# EAGLE design 7segement4digits1badidea-max6958-mk-1.0 (EAGLE 6.5.0)
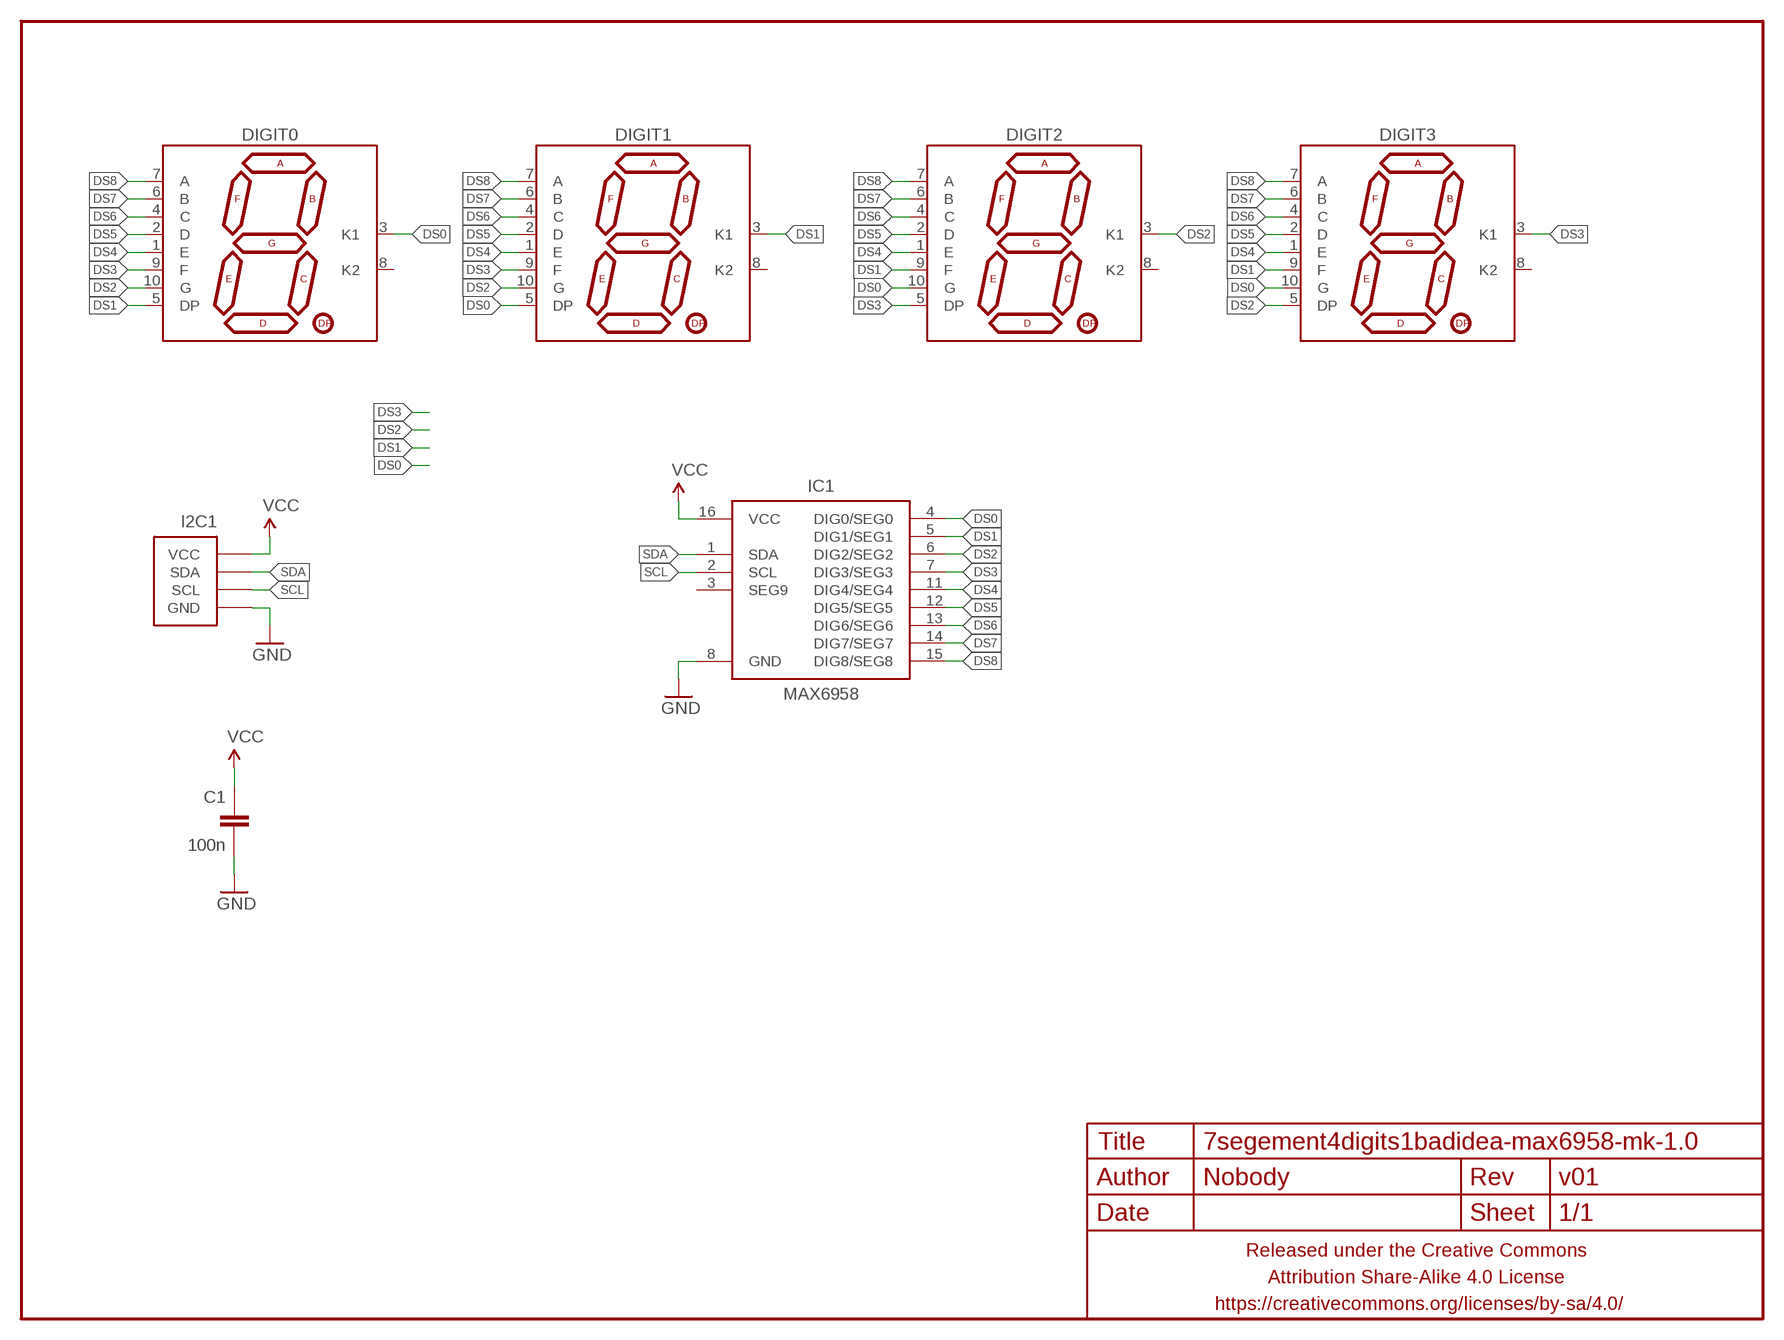
[diagram p0: schematic, sheet 1]

## Parts
C1  100n  CAPACITOR-CERAMIC025-024X044  [C025-024X044]
DIGIT0  7SEG_1DIGPTH-25.4MM  [7SEG_1DIG_25.4MM]
DIGIT1  7SEG_1DIGPTH-25.4MM  [7SEG_1DIG_25.4MM]
DIGIT2  7SEG_1DIGPTH-25.4MM  [7SEG_1DIG_25.4MM]
DIGIT3  7SEG_1DIGPTH-25.4MM  [7SEG_1DIG_25.4MM]
FRAME1  FRAME-LETTERNO_PACKAGE  [DUMMY]
I2C1  M04-I2CPTH-0.1IN-CENTERED  [1X04-PTH-VERT-I2C-CENTERED]
IC1  MAX6958  [DIL16]

## Nets
DS0: DIGIT0.3(K1) DIGIT1.5(DP) DIGIT2.10(G) DIGIT3.10(G) IC1.4(DIG0/SEG0)
DS1: DIGIT0.5(DP) DIGIT1.3(K1) DIGIT2.9(F) DIGIT3.9(F) IC1.5(DIG1/SEG1)
DS2: DIGIT0.10(G) DIGIT1.10(G) DIGIT2.3(K1) DIGIT3.5(DP) IC1.6(DIG2/SEG2)
DS3: DIGIT0.9(F) DIGIT1.9(F) DIGIT2.5(DP) DIGIT3.3(K1) IC1.7(DIG3/SEG3)
DS4: DIGIT0.1(E) DIGIT1.1(E) DIGIT2.1(E) DIGIT3.1(E) IC1.11(DIG4/SEG4)
DS5: DIGIT0.2(D) DIGIT1.2(D) DIGIT2.2(D) DIGIT3.2(D) IC1.12(DIG5/SEG5)
DS6: DIGIT0.4(C) DIGIT1.4(C) DIGIT2.4(C) DIGIT3.4(C) IC1.13(DIG6/SEG6)
DS7: DIGIT0.6(B) DIGIT1.6(B) DIGIT2.6(B) DIGIT3.6(B) IC1.14(DIG7/SEG7)
DS8: DIGIT0.7(A) DIGIT1.7(A) DIGIT2.7(A) DIGIT3.7(A) IC1.15(DIG8/SEG8)
GND: C1.2 I2C1.GND IC1.8(GND)
SCL: I2C1.SCL IC1.2(SCL)
SDA: I2C1.SDA IC1.1(SDA)
VCC: C1.1 I2C1.VCC IC1.16(VCC)
Unconnected: DIGIT0.8(K2) DIGIT1.8(K2) DIGIT2.8(K2) DIGIT3.8(K2) IC1.3(SEG9)

## Library data of the parts
C1 = A_butts:CAPACITOR-CERAMIC: CAPACITOR, European symbol
DIGIT0 DIGIT1-DIGIT3 = A_butts:7SEG_1DIG
FRAME1 = A_butts:FRAME-LETTER: Schematic Frame Standard 8.5x11 US Letter frame; DESIGNER: Nobody; VERSION: v01
I2C1 = A_butts:M04-I2C
IC1 = A_butts:MAX6958

## Board
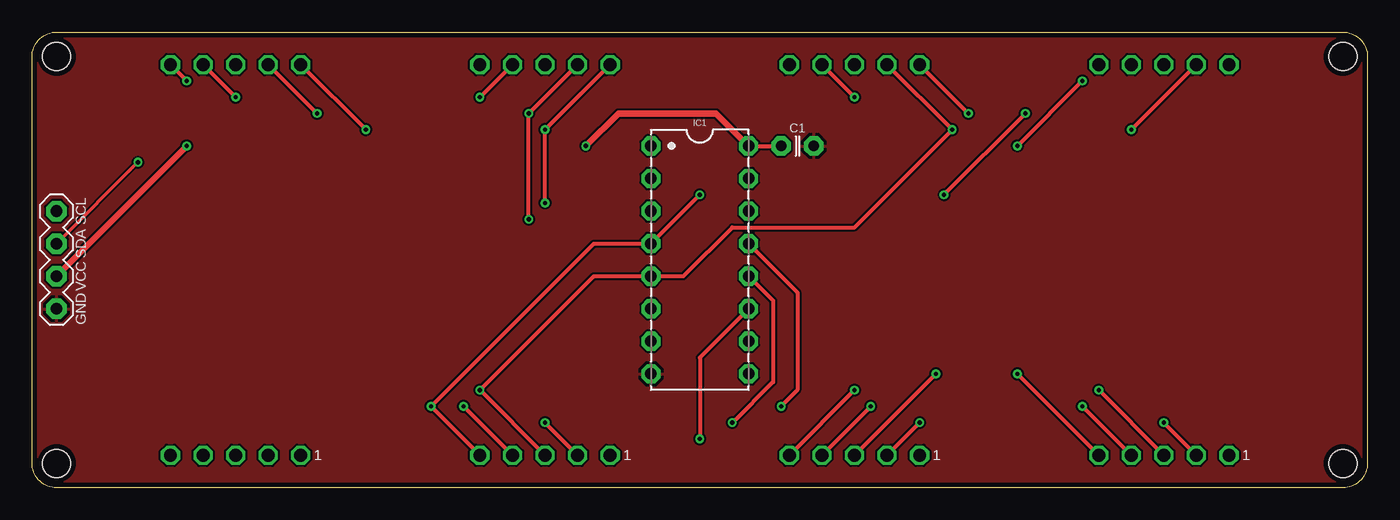
[diagram p1: board, top side]
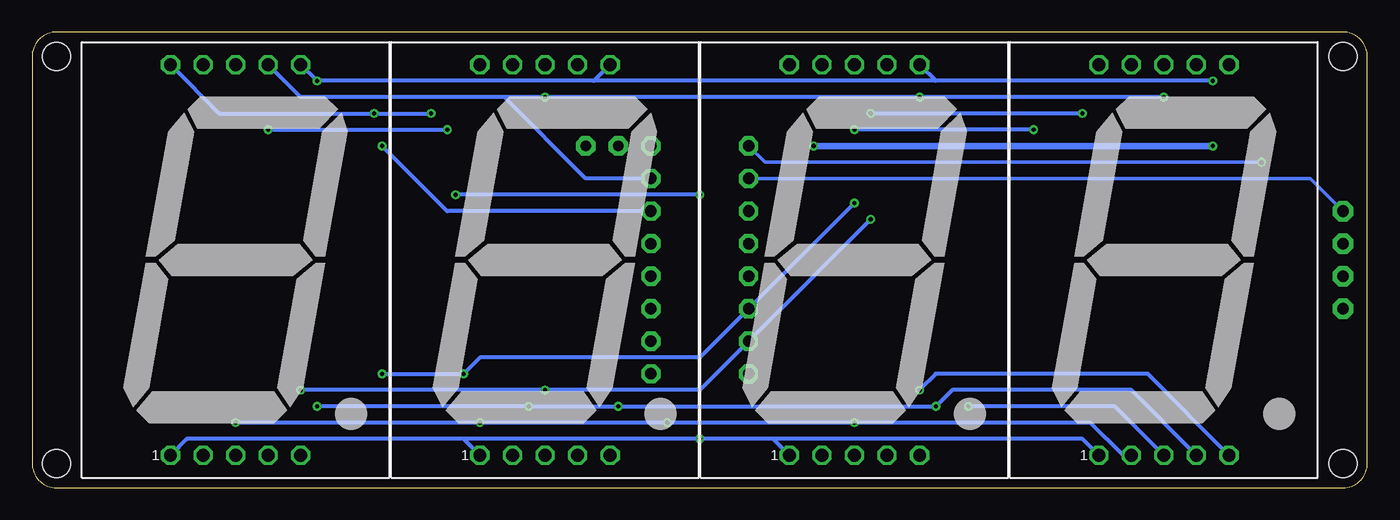
[diagram p2: board, bottom side, seen from below]

Size 104.14 x 35.56 mm. Coordinates in mm from the lower left corner, seen from the top.
Outline: 1.91,35.56 102.23,35.56 arc-90 104.14,33.66 104.14,1.91 arc-90 102.23,0 1.91,0 arc-90 0,1.91 0,33.66 arc-90 1.91,35.56
Copper layers (1*16): Top 0.0356mm / dielectric 1.5011mm / Bottom 0.0356mm
Design rules "LaenPCBOrder2": minimum track width 6mil, minimum drill 13mil, track to track 6mil, track to pad 6mil, pad to pad 6mil, via to via 6mil, smd to smd 6mil, copper to edge 15mil, drill to drill 6mil, minimum pad ring 7mil, minimum via ring 7mil, stop-mask expansion 3mil, vias tented up to drill 20mil, thermal gap 10mil
Holes 2.2 mm at 1.91,33.66 1.91,1.91 102.23,1.91 102.23,33.66

### Footprints (pad centres in the part's own frame; a part is rotated, then mirrored left to right if it is on the bottom)
C025-024X044 = drill 0.813 pad 1.5 octagon: 1 -1.27,0; 2 1.27,0
7SEG_1DIG_25.4MM = drill 1 pad 1.5 octagon: 1 -5.08,-15.24; 2 -2.54,-15.24; 3 0,-15.24; 4 2.54,-15.24; 5 5.08,-15.24; 6 5.08,15.24; 7 2.54,15.24; 8 0,15.24; 9 -2.54,15.24; 10 -5.08,15.24
1X04-PTH-VERT-I2C-CENTERED = drill 0.9 pad 1.6 octagon: GND -3.81,0; SCL 3.81,0; SDA 1.27,0; VCC -1.27,0
DIL16 = drill 0.9 pad 1.5 octagon: 1 -8.89,-3.81; 2 -6.35,-3.81; 3 -3.81,-3.81; 4 -1.27,-3.81; 5 1.27,-3.81; 6 3.81,-3.81; 7 6.35,-3.81; 8 8.89,-3.81; 9 8.89,3.81; 10 6.35,3.81; 11 3.81,3.81; 12 1.27,3.81; 13 -1.27,3.81; 14 -3.81,3.81; 15 -6.35,3.81; 16 -8.89,3.81

### Placement (x,y rotation side)
C1  59.69,26.67 0 top
DIGIT0  15.88,17.78 0 bottom
DIGIT1  40.01,17.78 0 bottom
DIGIT2  64.14,17.78 0 bottom
DIGIT3  88.27,17.78 0 bottom
FRAME1  -12.5,-13 0 top  (outside the outline)
I2C1  1.91,17.78 90 top
IC1  52.07,17.78 270 top

### Tracks (layer width: path | path; a pad name or v marks a point on that pad's centre or on a via)
DS0  (via drill 0.33)
  Top 0.305: v73.03,29.21 DIGIT2.10 | DIGIT1.5 v31.11,6.35 43.81,19.05 IC1.4 v52.07,22.86 | v71.12,22.86 v77.47,29.21
  Bottom 0.305: DIGIT3.10 89.53,29.21 v77.47,29.21 v73.03,29.21 | DIGIT0.3 19.68,6.35 v31.11,6.35 | v52.07,22.86 v71.12,22.86
DS1  (via drill 0.33)
  Top 0.305: DIGIT3.9 v85.72,27.94 | DIGIT2.9 v71.75,27.94 64.14,20.32 54.61,20.32 50.8,16.51 IC1.5 43.81,16.51 v34.92,7.62 DIGIT1.3
  Bottom 0.305: v85.72,27.94 v71.75,27.94 | DIGIT0.5 17.14,8.89 33.66,8.89 v34.92,7.62
DS2  (via drill 0.33)
  Top 0.305: DIGIT0.10 v26.04,27.94 | DIGIT1.10 v40.01,27.94 v40.01,22.23 | DIGIT3.5 v76.83,8.89 | v70.48,8.89 DIGIT2.3
  Bottom 0.305: v26.04,27.94 v40.01,27.94 | v76.83,8.89 v70.48,8.89 69.22,10.16 52.07,10.16 IC1.6 v40.01,22.23
DS3  (via drill 0.33)
  Top 0.305: DIGIT0.9 v22.23,29.21 | DIGIT1.9 v38.73,29.21 v38.73,20.95 | DIGIT2.5 v64.14,7.62 | v83.19,7.62 DIGIT3.3
  Bottom 0.305: v22.23,29.21 v38.73,29.21 | v83.19,7.62 v64.14,7.62 52.07,7.62 IC1.7 v38.73,20.95
DS4  (via drill 0.33)
  Top 0.305: IC1.11 52.07,10.16 v52.07,3.81
  Bottom 0.305: DIGIT0.1 22.23,3.81 46.35,3.81 | 46.35,3.81 v52.07,3.81 70.48,3.81 | 70.48,3.81 92.08,3.81 DIGIT3.1 | DIGIT2.1 70.48,3.81 | DIGIT1.1 46.35,3.81
DS5  (via drill 0.33)
  Top 0.305: v88.27,5.08 DIGIT3.2 | DIGIT1.2 v40.01,5.08 | DIGIT2.2 v69.22,5.08 | IC1.12 57.78,14.61 57.78,8.26 v54.61,5.08
  Bottom 0.305: DIGIT0.2 19.05,2.54 21.59,5.08 v40.01,5.08 v54.61,5.08 v69.22,5.08 v88.27,5.08
DS6  (via drill 0.33)
  Top 0.305: v33.66,6.35 DIGIT1.4 | DIGIT2.4 v65.41,6.35 | v81.92,6.35 DIGIT3.4 | IC1.13 59.69,15.24 59.69,7.62 v58.42,6.35
  Bottom 0.305: DIGIT0.4 18.41,7.62 32.38,7.62 v33.66,6.35 v58.42,6.35 v65.41,6.35 v81.92,6.35
DS7  (via drill 0.33)
  Top 0.305: DIGIT0.6 v12.06,31.75 | v76.83,26.67 v81.92,31.75
  Bottom 0.305: v12.06,31.75 33.66,31.75 | 33.66,31.75 60.33,31.75 | 60.33,31.75 v81.92,31.75 DIGIT3.6 | DIGIT1.6 33.66,31.75 | DIGIT2.6 60.33,31.75 | IC1.14 71.75,21.59 v76.83,26.67
DS8  (via drill 0.33)
  Top 0.305: DIGIT0.7 v15.88,30.48 | DIGIT2.7 v64.14,30.48 | DIGIT1.7 v34.92,30.48
  Bottom 0.305: v15.88,30.48 v34.92,30.48 v64.14,30.48 67.31,30.48 | 67.31,30.48 83.19,30.48 DIGIT3.7 | IC1.15 60.96,24.13 67.31,30.48
GND
  pour Top: 1.91,35.56 102.23,35.56 arc-90 104.14,33.66 104.14,1.91 arc-90 102.23,0 1.91,0 arc-90 0,1.91 0,33.66 arc-90
SCL
  Bottom 0.254: I2C1.SCL 4.45,24.13 IC1.2
SDA  (via drill 0.33)
  Top 0.254: I2C1.SDA v8.26,25.4
  Bottom 0.254: v8.26,25.4 46.99,25.4 IC1.1
VCC  (via drill 0.33)
  Top 0.305: IC1.16 C1.1
  Top 0.508: I2C1.VCC v12.06,26.67 | v43.18,26.67 45.72,29.21 53.34,29.21 IC1.16
  Bottom 0.508: v12.06,26.67 v43.18,26.67